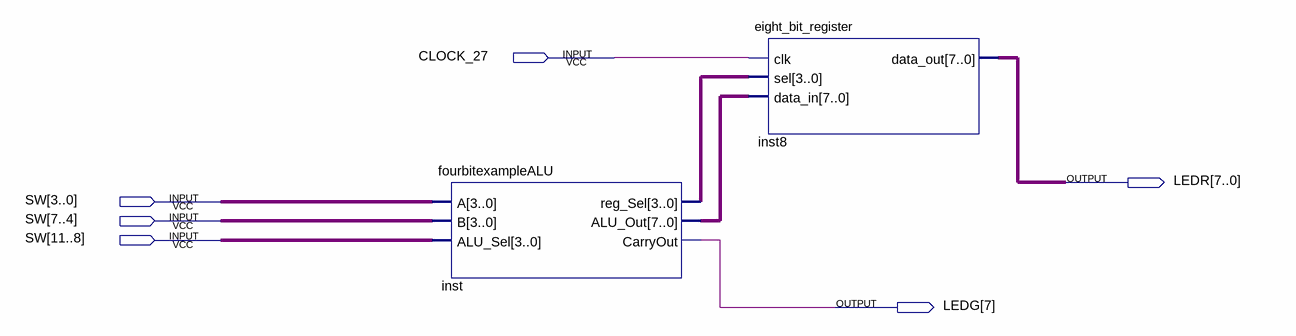
[diagram p0: schematic sheet]
// Quartus schematic blockdiagram.bdf as structural Verilog: 2 symbols, 6 pins
module blockdiagram (
  input  CLOCK_27,
  input  [11:0] SW,
  output [7:0] LEDR,
  output [7:7] LEDG
);

  wire [3:0] inst_reg_sel;
  wire [7:0] inst_alu_out;

  fourbitexampleALU inst (
    .A(SW[3:0]), .B(SW[7:4]), .ALU_Sel(SW[11:8]), .reg_Sel(inst_reg_sel), .ALU_Out(inst_alu_out),
    .CarryOut(LEDG[7]));
  eight_bit_register inst8 (.clk(CLOCK_27), .sel(inst_reg_sel), .data_in(inst_alu_out), .data_out(LEDR));
endmodule
